# Altium schematic sheet RGBLED.SchDoc
size A4
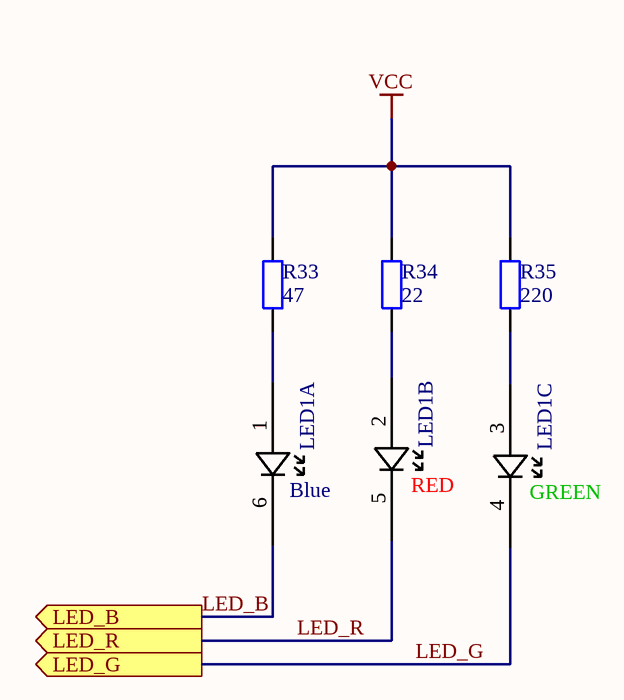
[diagram p0: RGBLED.SchDoc]

## Parts
LED1  LED_Red_Blue_Green  [SMLP36]  (value not drawn)  (parts A,B,C of 3)
R33  47  [RES 0603/1608]
R34  22  [RES 0603/1608]
R35  220  [RES 0603/1608]

## Ports
LED_B (out), LED_G (out), LED_R (out)

## Nets
VCC: R33.2 R34.2 R35.2
LED_B: LED1.6 ; port LED_B
LED_G: LED1.4 ; port LED_G
LED_R: LED1.5 ; port LED_R
NetLED1_1: LED1.1 R33.1
NetLED1_2: LED1.2 R34.1
NetLED1_3: LED1.3 R35.1

## Notes on the sheet
- (in symbol LED_Red_Blue_Green, part A) Blue
- (in symbol LED_Red_Blue_Green, part B) RED
- (in symbol LED_Red_Blue_Green, part C) GREEN

## Library data of the parts
LED1 = LED_Red_Blue_Green: PICOLED, Rouge, Vert, Bleu, CMS, Rectangulaire, R 5mA, G 5mA, B 5mA; Fournisseur: Farnell; RefFournisseur: 2507558RL; Fabricant: ROHM; RefFabricant: SMLP36RGB2W3R
R33 = Res2: YAGEO (PHYCOMP)  RC0805FR-0747RL  Résistance à puce CMS, Couche épaisse, 47 ohm, 150 V, 0805 [2012 Metric], 125 mW, ± 1%, Série RC; Fournisseur: Farnell; RefFournisseur: 9237321; Value: 47; Fabricant: YAGEO (PHYCOMP); refFabricant: RC0805FR-0747RL; Footprint: 0603
R34 = Res2: YAGEO (PHYCOMP)  RC0805FR-0722RL  Résistance à puce CMS, Couche épaisse, 22 ohm, 150 V, 0805 [2012 Metric], 125 mW, ± 1%, Série RC; Fournisseur: Farnell; RefFournisseur: 9237283; Value: 22; Fabricant: YAGEO (PHYCOMP); RefFabricant: RC0805FR-0722RL; Footprint: 0603
R35 = Res2: YAGEO (PHYCOMP)  RC0805FR-07220RL  Résistance à puce CMS, Couche épaisse, 220 ohm, 150 V, 0805 [2012 Metric], 125 mW, ± 1%, Série RC; Fournisseur: Farnell; RefFournisseur: 9237402; Value: 220; Fabricant: YAGEO (PHYCOMP); refFabricant: RC0805FR-07220RL; Footprint: 0603